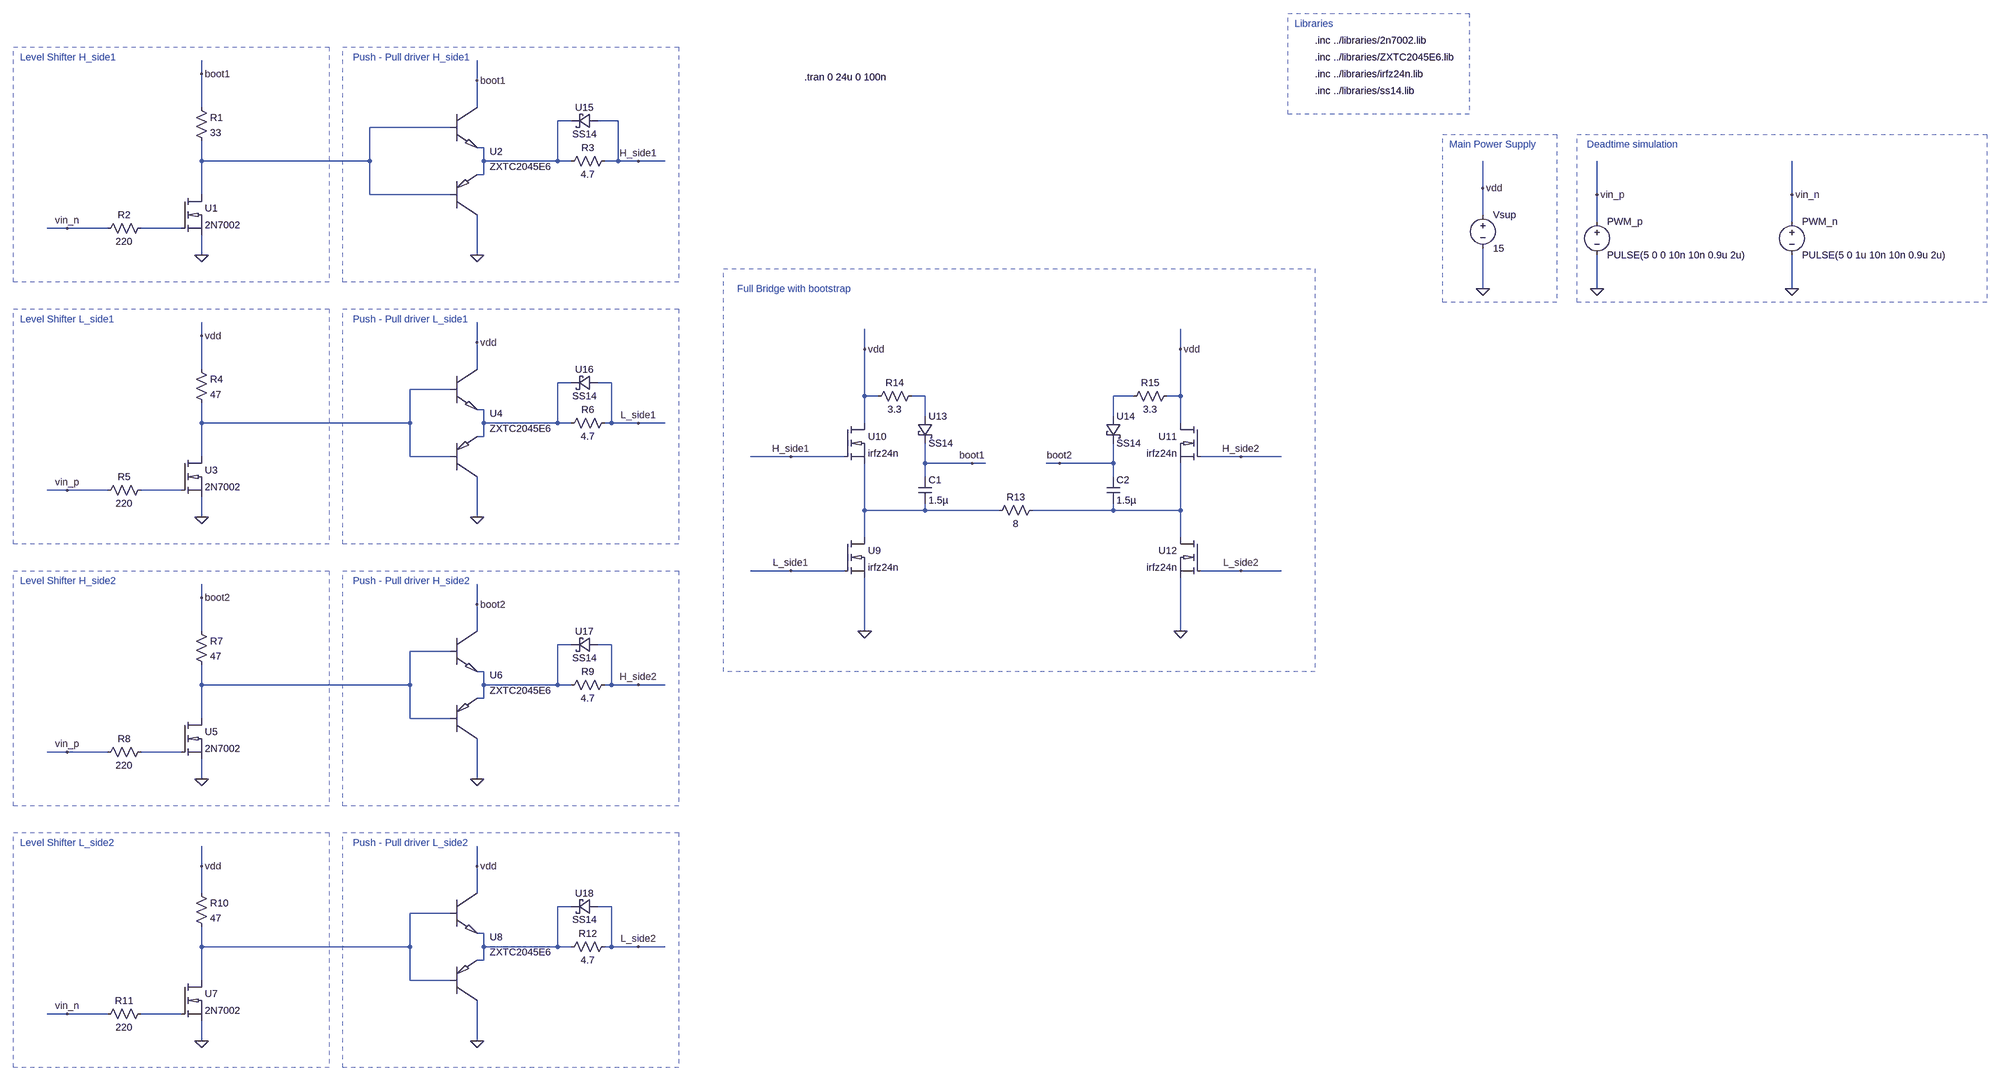
[diagram p0: schematic GateDriver.asc]
GateDriver.asc, the LTspice schematic file:
Version 4
SHEET 1 3956 2420
WIRE -384 48 -384 16
WIRE 272 64 272 16
WIRE -384 128 -384 48
WIRE 272 128 272 64
WIRE 496 160 464 160
WIRE 608 160 560 160
WIRE 208 176 16 176
WIRE 288 224 272 224
WIRE -384 256 -384 208
WIRE 16 256 16 176
WIRE 16 256 -384 256
WIRE 288 256 288 224
WIRE 464 256 464 160
WIRE 464 256 288 256
WIRE 496 256 464 256
WIRE 608 256 608 160
WIRE 608 256 576 256
WIRE 656 256 608 256
WIRE 720 256 656 256
WIRE 288 288 288 256
WIRE 288 288 272 288
WIRE 2752 320 2752 256
WIRE -384 336 -384 256
WIRE 16 336 16 256
WIRE 208 336 16 336
WIRE 3024 336 3024 256
WIRE 3488 336 3488 256
WIRE 2752 384 2752 320
WIRE 3024 400 3024 336
WIRE 3488 400 3488 336
WIRE -704 416 -752 416
WIRE -608 416 -704 416
WIRE -432 416 -528 416
WIRE -384 480 -384 432
WIRE 272 480 272 384
WIRE 2752 560 2752 464
WIRE 3024 560 3024 480
WIRE 3488 560 3488 480
WIRE -384 672 -384 640
WIRE 272 688 272 640
WIRE 1280 704 1280 656
WIRE 2032 704 2032 656
WIRE -384 752 -384 672
WIRE 272 752 272 688
WIRE 496 784 464 784
WIRE 592 784 560 784
WIRE 208 800 112 800
WIRE 1280 816 1280 704
WIRE 1312 816 1280 816
WIRE 1424 816 1392 816
WIRE 1920 816 1872 816
WIRE 2032 816 2032 704
WIRE 2032 816 2000 816
WIRE 288 848 272 848
WIRE 1424 864 1424 816
WIRE 1872 864 1872 816
WIRE -384 880 -384 832
WIRE 112 880 112 800
WIRE 112 880 -384 880
WIRE 288 880 288 848
WIRE 464 880 464 784
WIRE 464 880 288 880
WIRE 496 880 464 880
WIRE 592 880 592 784
WIRE 592 880 576 880
WIRE 656 880 592 880
WIRE 720 880 656 880
WIRE 1280 880 1280 816
WIRE 2032 880 2032 816
WIRE 288 912 288 880
WIRE 288 912 272 912
WIRE -384 960 -384 880
WIRE 112 960 112 880
WIRE 208 960 112 960
WIRE 1104 960 1008 960
WIRE 1232 960 1104 960
WIRE 2176 960 2080 960
WIRE 2272 960 2176 960
WIRE 1424 976 1424 928
WIRE 1536 976 1424 976
WIRE 1568 976 1536 976
WIRE 1744 976 1712 976
WIRE 1872 976 1872 928
WIRE 1872 976 1744 976
WIRE 1424 1008 1424 976
WIRE 1872 1008 1872 976
WIRE -704 1040 -752 1040
WIRE -608 1040 -704 1040
WIRE -432 1040 -528 1040
WIRE 1280 1088 1280 976
WIRE 1424 1088 1424 1072
WIRE 1424 1088 1280 1088
WIRE 1600 1088 1424 1088
WIRE 1872 1088 1872 1072
WIRE 1872 1088 1680 1088
WIRE 2032 1088 2032 976
WIRE 2032 1088 1872 1088
WIRE -384 1104 -384 1056
WIRE 272 1104 272 1008
WIRE 1280 1152 1280 1088
WIRE 2032 1152 2032 1088
WIRE 1104 1232 1008 1232
WIRE 1232 1232 1104 1232
WIRE 2176 1232 2080 1232
WIRE 2272 1232 2176 1232
WIRE -384 1296 -384 1264
WIRE 272 1312 272 1264
WIRE -384 1376 -384 1296
WIRE 272 1376 272 1312
WIRE 1280 1376 1280 1248
WIRE 2032 1376 2032 1248
WIRE 496 1408 464 1408
WIRE 592 1408 560 1408
WIRE 208 1424 112 1424
WIRE 288 1472 272 1472
WIRE -384 1504 -384 1456
WIRE 112 1504 112 1424
WIRE 112 1504 -384 1504
WIRE 288 1504 288 1472
WIRE 464 1504 464 1408
WIRE 464 1504 288 1504
WIRE 496 1504 464 1504
WIRE 592 1504 592 1408
WIRE 592 1504 576 1504
WIRE 656 1504 592 1504
WIRE 720 1504 656 1504
WIRE 288 1536 288 1504
WIRE 288 1536 272 1536
WIRE -384 1584 -384 1504
WIRE 112 1584 112 1504
WIRE 208 1584 112 1584
WIRE -704 1664 -752 1664
WIRE -608 1664 -704 1664
WIRE -432 1664 -528 1664
WIRE -384 1728 -384 1680
WIRE 272 1728 272 1632
WIRE -384 1936 -384 1888
WIRE 272 1936 272 1888
WIRE -384 2000 -384 1936
WIRE 272 2000 272 1936
WIRE 496 2032 464 2032
WIRE 592 2032 560 2032
WIRE 208 2048 112 2048
WIRE 288 2096 272 2096
WIRE -384 2128 -384 2080
WIRE 112 2128 112 2048
WIRE 112 2128 -384 2128
WIRE 288 2128 288 2096
WIRE 464 2128 464 2032
WIRE 464 2128 288 2128
WIRE 496 2128 464 2128
WIRE 592 2128 592 2032
WIRE 592 2128 576 2128
WIRE 656 2128 592 2128
WIRE 720 2128 656 2128
WIRE 288 2160 288 2128
WIRE 288 2160 272 2160
WIRE -384 2208 -384 2128
WIRE 112 2208 112 2128
WIRE 208 2208 112 2208
WIRE -704 2288 -752 2288
WIRE -608 2288 -704 2288
WIRE -432 2288 -528 2288
WIRE -384 2352 -384 2304
WIRE 272 2352 272 2256
FLAG -384 480 0
FLAG -704 416 vin_n
FLAG -384 48 boot1
FLAG 272 480 0
FLAG 272 64 boot1
FLAG 656 256 H_side1
FLAG 272 1104 0
FLAG 272 688 vdd
FLAG 656 880 L_side1
FLAG 272 1728 0
FLAG 272 1312 boot2
FLAG 656 1504 H_side2
FLAG 272 2352 0
FLAG 272 1936 vdd
FLAG 656 2128 L_side2
FLAG 1280 1376 0
FLAG 2032 1376 0
FLAG 1280 704 vdd
FLAG 2032 704 vdd
FLAG 2752 560 0
FLAG 3024 560 0
FLAG 3488 560 0
FLAG 2752 320 vdd
FLAG 3024 336 vin_p
FLAG 3488 336 vin_n
FLAG 1536 976 boot1
FLAG 1744 976 boot2
FLAG 1104 960 H_side1
FLAG 1104 1232 L_side1
FLAG 2176 960 H_side2
FLAG 2176 1232 L_side2
FLAG -704 1040 vin_p
FLAG -384 1104 0
FLAG -384 672 vdd
FLAG -704 1664 vin_p
FLAG -384 1728 0
FLAG -384 1296 boot2
FLAG -704 2288 vin_n
FLAG -384 2352 0
FLAG -384 1936 vdd
SYMBOL 2n7002 -432 336 R0
SYMATTR InstName U1
SYMBOL res -400 112 R0
SYMATTR InstName R1
SYMATTR Value 33
SYMBOL res -512 400 R90
WINDOW 0 0 56 VBottom 2
WINDOW 3 32 56 VTop 2
SYMATTR InstName R2
SYMATTR Value 220
SYMBOL ZXTC2045E6 208 144 R0
SYMATTR InstName U2
SYMBOL res 592 240 R90
WINDOW 0 0 56 VBottom 2
WINDOW 3 32 56 VTop 2
SYMATTR InstName R3
SYMATTR Value 4.7
SYMBOL ZXTC2045E6 208 768 R0
SYMATTR InstName U4
SYMBOL res 592 864 R90
WINDOW 0 0 56 VBottom 2
WINDOW 3 32 56 VTop 2
SYMATTR InstName R6
SYMATTR Value 4.7
SYMBOL ZXTC2045E6 208 1392 R0
SYMATTR InstName U6
SYMBOL res 592 1488 R90
WINDOW 0 0 56 VBottom 2
WINDOW 3 32 56 VTop 2
SYMATTR InstName R9
SYMATTR Value 4.7
SYMBOL ZXTC2045E6 208 2016 R0
SYMATTR InstName U8
SYMBOL res 592 2112 R90
WINDOW 0 0 56 VBottom 2
WINDOW 3 32 56 VTop 2
SYMATTR InstName R12
SYMATTR Value 4.7
SYMBOL res 1696 1072 R90
WINDOW 0 0 56 VBottom 2
WINDOW 3 32 56 VTop 2
SYMATTR InstName R13
SYMATTR Value 8
SYMBOL voltage 2752 368 R0
WINDOW 123 0 0 Left 0
WINDOW 39 0 0 Left 0
SYMATTR InstName Vsup
SYMATTR Value 15
SYMBOL voltage 3024 384 R0
WINDOW 123 0 0 Left 0
WINDOW 39 0 0 Left 0
SYMATTR InstName PWM_p
SYMATTR Value PULSE(5 0 0 10n 10n 0.9u 2u)
SYMBOL voltage 3488 384 R0
WINDOW 123 0 0 Left 0
WINDOW 39 0 0 Left 0
SYMATTR InstName PWM_n
SYMATTR Value PULSE(5 0 1u 10n 10n 0.9u 2u)
SYMBOL cap 1408 1008 R0
SYMATTR InstName C1
SYMATTR Value 1.5µ
SYMBOL cap 1856 1008 R0
SYMATTR InstName C2
SYMATTR Value 1.5µ
SYMBOL SS14 1408 864 R0
SYMATTR InstName U13
SYMBOL SS14 1856 864 R0
SYMATTR InstName U14
SYMBOL res 1408 800 R90
WINDOW 0 0 56 VBottom 2
WINDOW 3 32 56 VTop 2
SYMATTR InstName R14
SYMATTR Value 3.3
SYMBOL res 2016 800 R90
WINDOW 0 0 56 VBottom 2
WINDOW 3 32 56 VTop 2
SYMATTR InstName R15
SYMATTR Value 3.3
SYMBOL SS14 560 768 R90
WINDOW 0 0 32 VBottom 2
WINDOW 3 32 32 VTop 2
SYMATTR InstName U16
SYMBOL SS14 560 1392 R90
WINDOW 0 0 32 VBottom 2
WINDOW 3 32 32 VTop 2
SYMATTR InstName U17
SYMBOL SS14 560 2016 R90
WINDOW 0 0 32 VBottom 2
WINDOW 3 32 32 VTop 2
SYMATTR InstName U18
SYMBOL irfz24n 1232 1152 R0
SYMATTR InstName U9
SYMBOL irfz24n 1232 880 R0
SYMATTR InstName U10
SYMBOL irfz24n 2080 880 M0
SYMATTR InstName U11
SYMBOL irfz24n 2080 1152 M0
SYMATTR InstName U12
SYMBOL 2n7002 -432 960 R0
SYMATTR InstName U3
SYMBOL res -400 736 R0
SYMATTR InstName R4
SYMATTR Value 47
SYMBOL res -512 1024 R90
WINDOW 0 0 56 VBottom 2
WINDOW 3 32 56 VTop 2
SYMATTR InstName R5
SYMATTR Value 220
SYMBOL 2n7002 -432 1584 R0
SYMATTR InstName U5
SYMBOL res -400 1360 R0
SYMATTR InstName R7
SYMATTR Value 47
SYMBOL res -512 1648 R90
WINDOW 0 0 56 VBottom 2
WINDOW 3 32 56 VTop 2
SYMATTR InstName R8
SYMATTR Value 220
SYMBOL 2n7002 -432 2208 R0
SYMATTR InstName U7
SYMBOL res -400 1984 R0
SYMATTR InstName R10
SYMATTR Value 47
SYMBOL res -512 2272 R90
WINDOW 0 0 56 VBottom 2
WINDOW 3 32 56 VTop 2
SYMATTR InstName R11
SYMATTR Value 220
SYMBOL SS14 560 144 R90
WINDOW 0 0 32 VBottom 2
WINDOW 3 32 32 VTop 2
SYMATTR InstName U15
TEXT 2352 -32 Left 2 !.inc ../libraries/2n7002.lib
TEXT -816 8 Left 2 ;Level Shifter H_side1
TEXT -24 8 Left 2 ;Push - Pull driver H_side1
TEXT -816 632 Left 2 ;Level Shifter L_side1
TEXT -24 632 Left 2 ;Push - Pull driver L_side1
TEXT 2352 8 Left 2 !.inc ../libraries/ZXTC2045E6.lib
TEXT -816 1256 Left 2 ;Level Shifter H_side2
TEXT -24 1256 Left 2 ;Push - Pull driver H_side2
TEXT -816 1880 Left 2 ;Level Shifter L_side2
TEXT -24 1880 Left 2 ;Push - Pull driver L_side2
TEXT 2352 48 Left 2 !.inc ../libraries/irfz24n.lib
TEXT 2352 88 Left 2 !.inc ../libraries/ss14.lib
TEXT 976 560 Left 2 ;Full Bridge with bootstrap
TEXT 3000 216 Left 2 ;Deadtime simulation
TEXT 2672 216 Left 2 ;Main Power Supply
TEXT 2304 -72 Left 2 ;Libraries
TEXT 1136 56 Left 2 !.tran 0 24u 0 100n
RECTANGLE Normal -80 544 -832 -16 2
RECTANGLE Normal 752 544 -48 -16 2
RECTANGLE Normal -80 1168 -832 608 2
RECTANGLE Normal 752 1168 -48 608 2
RECTANGLE Normal -80 1792 -832 1232 2
RECTANGLE Normal 752 1792 -48 1232 2
RECTANGLE Normal -80 2416 -832 1856 2
RECTANGLE Normal 752 2416 -48 1856 2
RECTANGLE Normal 2352 1472 944 512 2
RECTANGLE Normal 3952 592 2976 192 2
RECTANGLE Normal 2928 592 2656 192 2
RECTANGLE Normal 2720 144 2288 -96 2

The netlist it stands for:
* GateDriver.asc
XU1 N002 N003 0 2N7002  ; pins D G S
R1 boot1 N002 33
R2 N003 vin_n 220
XU2 boot1 N002 0 N001 N002 N001 ZXTC2045E6  ; pins C B C1 E1 B1 E
R3 H_side1 N001 4.7
XU4 vdd N005 0 N004 N005 N004 ZXTC2045E6  ; pins C B C1 E1 B1 E
R6 L_side1 N004 4.7
XU6 boot2 N012 0 N011 N012 N011 ZXTC2045E6  ; pins C B C1 E1 B1 E
R9 H_side2 N011 4.7
XU8 vdd N015 0 N014 N015 N014 ZXTC2045E6  ; pins C B C1 E1 B1 E
R12 L_side2 N014 4.7
R13 N010 N009 8
Vsup vdd 0 15
V§PWM_p vin_p 0 PULSE(5 0 0 10n 10n 0.9u 2u)
V§PWM_n vin_n 0 PULSE(5 0 1u 10n 10n 0.9u 2u)
C1 boot1 N009 1.5µ
C2 boot2 N010 1.5µ
XU13 N006 boot1 SS14  ; pins + -
XU14 N007 boot2 SS14  ; pins + -
R14 N006 vdd 3.3
R15 vdd N007 3.3
XU16 L_side1 N004 SS14  ; pins + -
XU17 H_side2 N011 SS14  ; pins + -
XU18 L_side2 N014 SS14  ; pins + -
XU9 N009 L_side1 0 irfz24n  ; pins D G S
XU10 vdd H_side1 N009 irfz24n  ; pins D G S
XU11 vdd H_side2 N010 irfz24n  ; pins D G S
XU12 N010 L_side2 0 irfz24n  ; pins D G S
XU3 N005 N008 0 2N7002  ; pins D G S
R4 vdd N005 47
R5 N008 vin_p 220
XU5 N012 N013 0 2N7002  ; pins D G S
R7 boot2 N012 47
R8 N013 vin_p 220
XU7 N015 N016 0 2N7002  ; pins D G S
R10 vdd N015 47
R11 N016 vin_n 220
XU15 H_side1 N001 SS14  ; pins + -
.inc ../libraries/2n7002.lib
* Level Shifter H_side1
* Push - Pull driver H_side1
* Level Shifter L_side1
* Push - Pull driver L_side1
.inc ../libraries/ZXTC2045E6.lib
* Level Shifter H_side2
* Push - Pull driver H_side2
* Level Shifter L_side2
* Push - Pull driver L_side2
.inc ../libraries/irfz24n.lib
.inc ../libraries/ss14.lib
* Full Bridge with bootstrap
* Deadtime simulation
* Main Power Supply
* Libraries
.tran 0 24u 0 100n
.backanno
.end